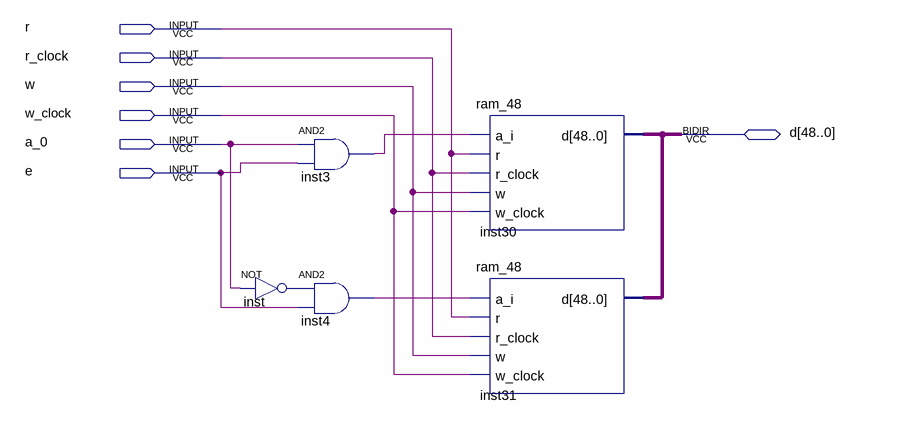
[diagram p0: schematic sheet]
// Quartus schematic ram_48x2.bdf as structural Verilog: 5 symbols, 7 pins
module ram_48x2 (
  input  r,
  input  r_clock,
  input  w,
  input  w_clock,
  input  a_0,
  input  e,
  inout  [48:0] d
);

  wire inst3_out, inst4_out, inst_out;

  not inst (inst_out, a_0);
  and inst3 (inst3_out, a_0, e);
  and inst4 (inst4_out, inst_out, e);
  ram_48 inst30 (.a_i(inst3_out), .r(r), .r_clock(r_clock), .w(w), .w_clock(w_clock), .d(d));
  ram_48 inst31 (.a_i(inst4_out), .r(r), .r_clock(r_clock), .w(w), .w_clock(w_clock), .d(d));
endmodule
